# EAGLE design Adafruit STEMMA Soil Sensor (EAGLE 9.2.0)
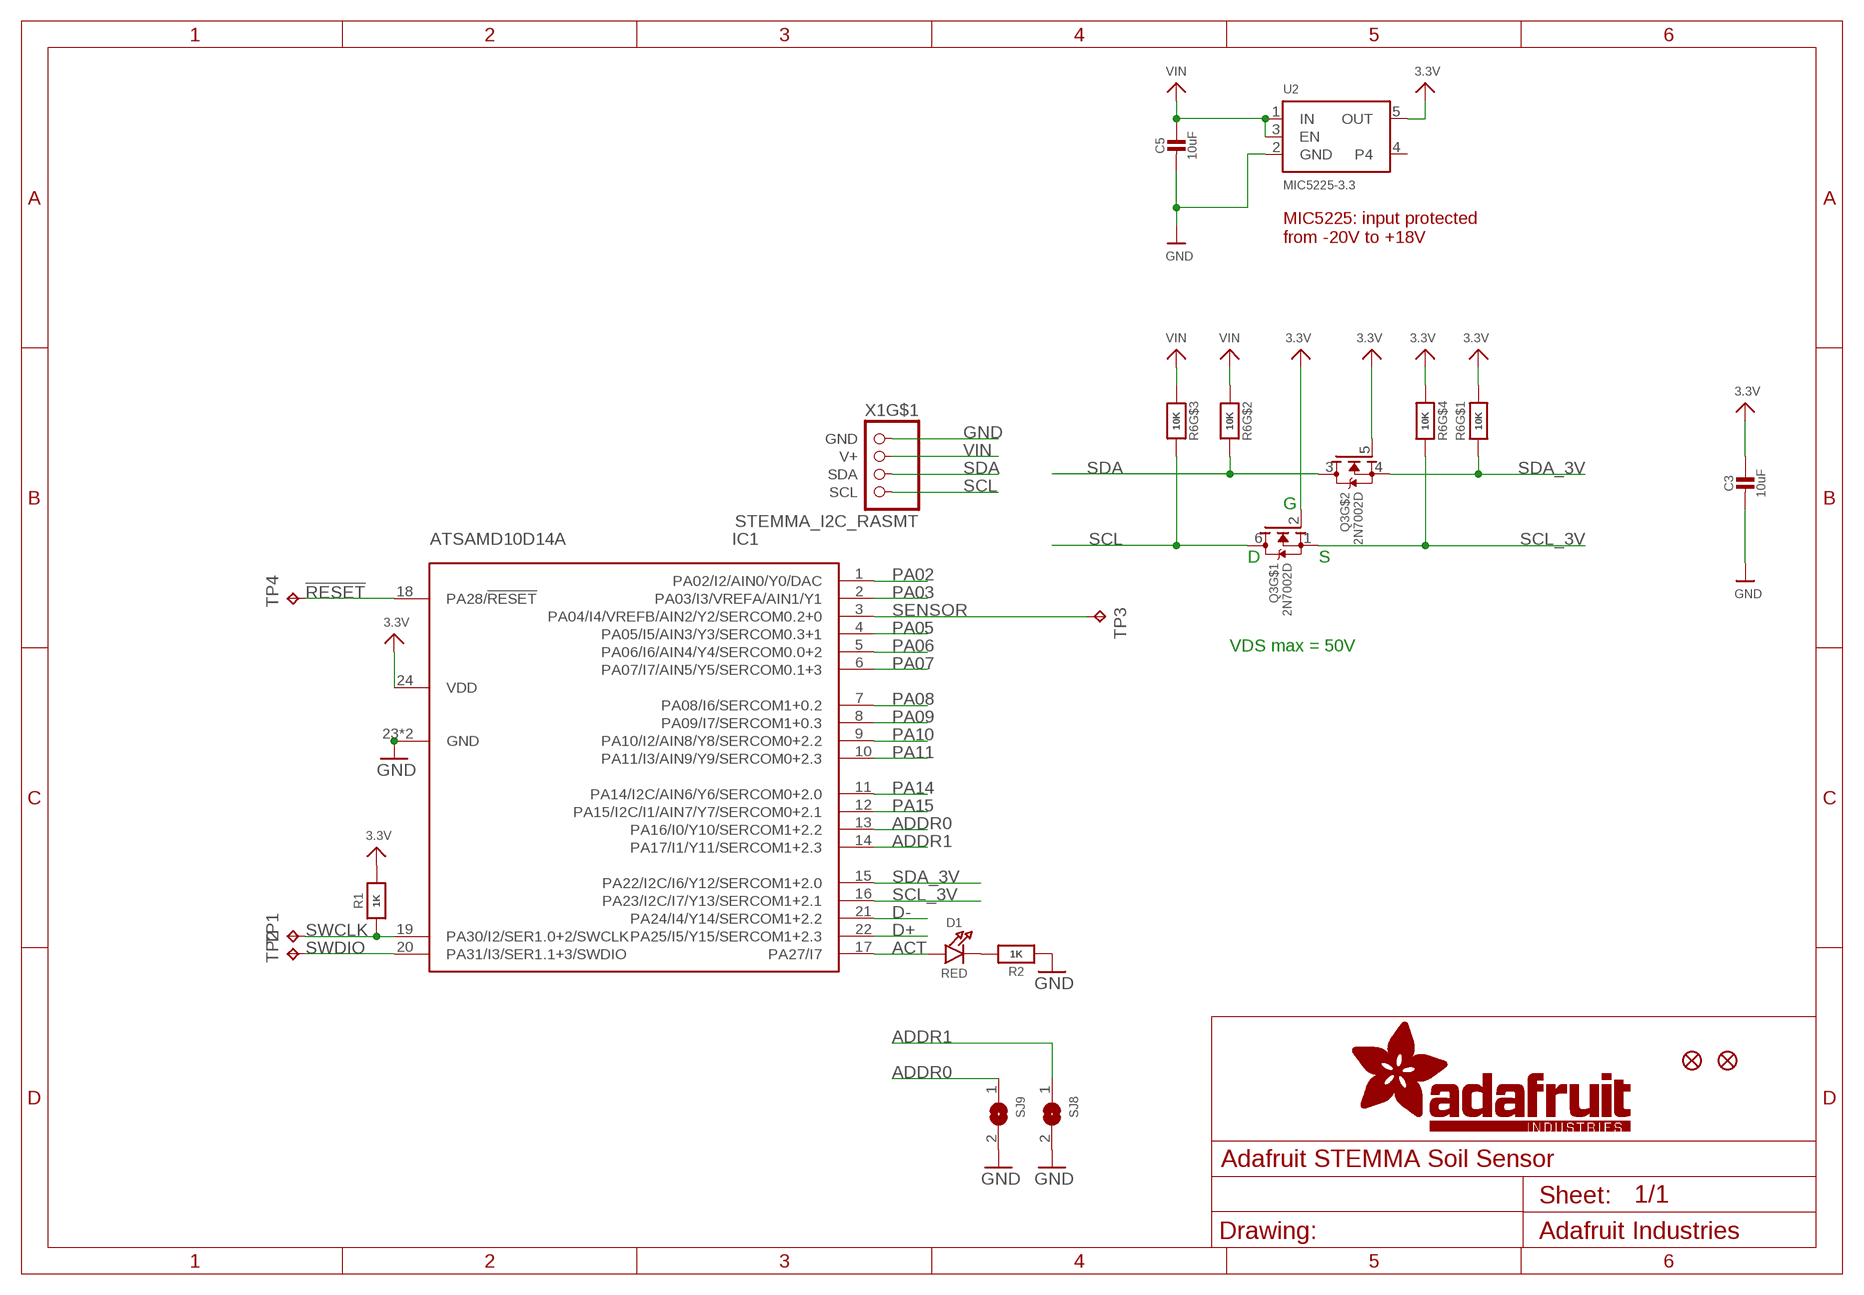
[diagram p0: schematic, sheet 1]

## Parts
C3  10uF  CAP_CERAMIC0805-NOOUTLINE  [0805-NO]
C5  10uF  CAP_CERAMIC0805-NOOUTLINE  [0805-NO]
D1  RED  LED0805_NOOUTLINE  [CHIPLED_0805_NOOUTLINE]
FID1  FIDUCIAL_1MM  [FIDUCIAL_1MM]
FID2  FIDUCIAL_1MM  [FIDUCIAL_1MM]
IC1  ATSAMD10D14A  [QFN24_4MM]
Q3  2N7002D  MOSFET-N_DUAL  [SOT363]
R1  1K  RESISTOR_0603_NOOUT  [0603-NO]
R2  1K  RESISTOR_0603_NOOUT  [0603-NO]
R6  10K  RESISTOR_4PACK  [RESPACK_4X0603]
SJ8  SOLDERJUMPER  [SOLDERJUMPER_ARROW_NOPASTE]
SJ9  SOLDERJUMPER  [SOLDERJUMPER_ARROW_NOPASTE]
TP1  TPTP15R  [TP15R]
TP2  TPTP15R  [TP15R]
TP3  TPTP10R  [TP10R]
TP4  TPTP15R  [TP15R]
U2  MIC5225-3.3  VREG_SOT23-5  [SOT23-5]
X1  STEMMA_I2C_RASMT  [JSTPH4]

## Nets
3.3V: C3.1 IC1.24(VDD) Q3.2(G) Q3.5(G) R1.2 R6.1 R6.5 U2.5(OUT)
!RESET: IC1.18(PA28/!RESET) TP4.TP
ACT: D1.A IC1.17(PA27/I7)
ADDR0: IC1.13(PA16/I0/Y10/SERCOM1+2.2) SJ9.1
ADDR1: IC1.14(PA17/I1/Y11/SERCOM1+2.3) SJ8.1
D+: IC1.22(PA25/I5/Y15/SERCOM1+2.3)
D-: IC1.21(PA24/I4/Y14/SERCOM1+2.2)
GND: C3.2 C5.2 IC1.23(GND) IC1.THERM(GND) R2.1 SJ8.2 SJ9.2 U2.2(GND) X1.1(GND)
N$2: D1.C R2.2
PA02: IC1.1(PA02/I2/AIN0/Y0/DAC)
PA03: IC1.2(PA03/I3/VREFA/AIN1/Y1)
PA05: IC1.4(PA05/I5/AIN3/Y3/SERCOM0.3+1)
PA06: IC1.5(PA06/I6/AIN4/Y4/SERCOM0.0+2)
PA07: IC1.6(PA07/I7/AIN5/Y5/SERCOM0.1+3)
PA08: IC1.7(PA08/I6/SERCOM1+0.2)
PA09: IC1.8(PA09/I7/SERCOM1+0.3)
PA10: IC1.9(PA10/I2/AIN8/Y8/SERCOM0+2.2)
PA11: IC1.10(PA11/I3/AIN9/Y9/SERCOM0+2.3)
PA14: IC1.11(PA14/I2C/AIN6/Y6/SERCOM0+2.0)
PA15: IC1.12(PA15/I2C/I1/AIN7/Y7/SERCOM0+2.1)
SCL: Q3.6(D) R6.6 X1.4(SCL)
SCL_3V: IC1.16(PA23/I2C/I7/Y13/SERCOM1+2.1) Q3.1(S) R6.4
SDA: Q3.3(D) R6.7 X1.3(SDA)
SDA_3V: IC1.15(PA22/I2C/I6/Y12/SERCOM1+2.0) Q3.4(S) R6.8
SENSOR: IC1.3(PA04/I4/VREFB/AIN2/Y2/SERCOM0.2+0) TP3.TP
SWCLK: IC1.19(PA30/I2/SER1.0+2/SWCLK) R1.1 TP1.TP
SWDIO: IC1.20(PA31/I3/SER1.1+3/SWDIO) TP2.TP
VIN: C5.1 R6.2 R6.3 U2.1(IN) U2.3(EN) X1.2(V+)
Unconnected: U2.4 X1.NC1(MT) X1.NC2(MT)

## Notes on the sheet
- MIC5225: input protected
  from -20V to +18V
- G
- D | S
- VDS max = 50V

## Library data of the parts
C3 C5 = microbuilder:CAP_CERAMIC: Ceramic Capacitors For new designs, use the packages preceded by an '_' character since they are more reliable: The following footprints should be used on most boards: _0402 - Standard footprint for regular board layouts _0603 - Standard footprint for regular board layouts _0805 - Standard footprint for regular board layouts _1206 - Standard footprint for regular board layouts For extremely tight-pitch boards where space is at a premium, the following 'micro-pitch' footprints can be used (smaller pads, no silkscreen outline, etc.): _0402MP - Micro-pitch footprint for very dense/compact boards _0603MP - Micro-pitch footprint for very dense/compact boards _0805MP - Micro-pitch footprint for very dense/compact boards _1206MP - Micro-pitch footprint for very dense/compact boards
D1 = microbuilder:LED: LED 0603 - 0603 Surface Mount Package 2mA: Green LED - Low Power (3.9mcd, 2ma, 1.7Vf) - Digikey: 475-2709-2-ND Orange LED - Low Power (9.8mcd, 2ma, 1.8Vf) - Digikey: 475-1194-2-ND Red LED - Low Power (5mcd, 2ma, 1.8Vf) - Digikey: 475-1195-2-ND Yellow LED - Low Power (7mcd, 2ma, 1.8Vf) - Digikey: 475-1196-2-ND 5mA: Blue LED - Low Power (17mcd, 5ma, 2.9Vf) - Digikey: LNJ937W8CRACT-ND 0805 - 0805 Surface Mount Package 2mA: Red LED (8.8mcd, 2mA, 1.8Vf, Clear) - Low Power [Digikey: 475-2510-1-ND] Green LED (5mcd, 2mA, 1.8Vf, Clear) - Low Power [Digikey: 475-2730-1-ND] Yellow LED (11.3mcd, 2mA, 1.8Vf, Clear) - Low Power [Digikey: 475-2555-1-ND] 20mA: Red LED (104mcd, 20mA, Diffused) - LS R976 [Digikey: 475-1278-6-ND] Red LED (12mcd, 20mA, 2.0Vf, Clear) - APT2012EC [Digikey: 754-1128-1-ND] Green LED (15mcd, 20mA, 2.2Vf, Clear) - APT2012GC [Digikey: 754-1131-1-ND] Orange LED (160mcd, 20mA, 2.1Vf, Clear) - APT2012SECK [Digikey: 754-1130-1-ND] 1206 - 1206 Surface Mount Package Green LED (26mcd, 20mA, Diffused) - LG N971 [Digikey: 475-1407-6-ND] Red LED (15mcd, 20mA, Diffused) - LH N974 [Digikey: 475-1416-6-ND] Cree - Cree High-Power Surface Mount LEDs XPEBWT-L1-0000-00D50 - White 111lm 350mA 2.9Vf 6200K 110° XTEAWT-00-0000-00000LEE3 - White 114lm 350mA 2.85Vf 5000K 115° Everlight - Everlight 45-21 Series Surface Mount LEDs 45-21/QK2C-B2832AC2CB2/2T - Warm White 2000mcd 20mA 3.25Vf 3050K 120° 45-21/LK2C-B38452C4CB2/2T - Nuetral White 2000mcd 20mA 3.25Vf 4150K 120° 45-21/LK2C-B50634C6CB2/2T - Cold White 2200mcd 20mA 3.25Vf 5650K 120° PLCC2 Reverse Mount LS T77K-J1L2-1-0-2-R18-Z - Red 11.25mcd 2mA 1.8Vf 630nm 120° LO T77K-L1M2-24-Z - Orange 19.6mcd 2mA 1.8Vf 606nm 120° LY T77K-K2M1-26-Z - Yellow 15.7mcd 2mA 1.8Vf 587nm 120°
FID1 FID2 = microbuilder:FIDUCIAL: Fiducial Alignment Points Various fiducial points for machine vision alignment.; BOM: EXCLUDE
IC1 = microbuilder:ATSAMD10D14A
Q3 = microbuilder:MOSFET-N_DUAL: Dual N-Channel MOSFET SOT363 (2.0x1.25mm) 2N7002PS - 60V, 320mA [Digikey: 568-5984-1-ND]
R1 R2 = microbuilder:RESISTOR: Resistors For new designs, use the packages preceded by an '_' character since they are more reliable: The following footprints should be used on most boards: _0402 - Standard footprint for regular board layouts _0603 - Standard footprint for regular board layouts _0805 - Standard footprint for regular board layouts _1206 - Standard footprint for regular board layouts For extremely tight-pitch boards where space is at a premium, the following 'micro-pitch' footprints can be used (smaller pads, no silkscreen outline, etc.): _0402MP - Micro-pitch footprint for very dense/compact boards _0603MP - Micro-pitch footprint for very dense/compact boards _0805MP - Micro-pitch footprint for very dense/compact boards _1206MP - Micro-pitch footprint for very dense/compact boards
R6 = microbuilder:RESISTOR_4PACK: Resistor Packs (4 resistors) 4 x 0603 10K 1/16W - Digikey: YC164J-10KCT-ND
SJ8 SJ9 = microbuilder:SOLDERJUMPER: SMD Solder JUMPER Solder the two pads together to create a connection, or remove the solder to break it. REFLOW - Use this footprint for solder paste and reflow ovens. WAVE - Use this footprint for hand-soldering (larger pads). CLOSED - Has a trace between the two pads to ensure it is closed by default. The trace needs to be cut to disable the jumper, and can be closed again by creating a solder bridge between the two pads.; BOM: EXCLUDE
TP1-TP4 = testpad:TP: Test pad
U2 = microbuilder:VREG_SOT23-5: SOT23-5 Fixed Voltage Regulators Part Current Out V Out V In V Dropout θJA (°C/W) TJ (°C) Digikey Part No. ADP121 150mA 3.3V 3.4-5.5V 0.09V @ 150mA -- -- ADP121-AUJZ33R7CT-ND ADP121 150mA 3.0V 3.1-5.5V 0.09V @ 150mA -- -- ADP121-AUJZ30R7CT-ND ADP122 300mA 3.3V 3.4-5.5V 0.085V @ 300mA -- -- ADP122AUJZ-3.3-R7CT-ND ADP1712 300mA 3.3V 3.5-5.5V 0.17V @ 300mA -- -- ADP1712AUJZ-3.3-R7TR-ND AP7311 (Low Cost) 150mA 3.3V 3.5-6V 0.15V @ 150mA -- -- AP7311-33WG-7DICT-ND LD39015M18R 150mA 1.8V 1.9V-5.5V 0.08V @ 100mA -- -- 497-6977-1-ND LP2985A-33DBVR 150mA 3.3V 3.3-16V 0.28V @ 150mA 206 150 296-18479-1-ND MCP1824T-3302E/OT 300mA 3.3V 3.5V-6V 0.2V @ 300mA -- -- MCP1824T-3302E/OTCT-ND MIC5205-2.5YM5 TR 150mA 2.5V 2.7-16V 0.165V @ 150mA -- -- 576-1257-2-ND MIC5205-3.0YM5 TR 150mA 3.0V 3.2V-16V 0.165V @ 150mA -- -- 576-1258-2-ND MIC5205-3.3YM5 TR 150mA 3.3V 3.5V-16V 0.165V @ 150mA -- -- 576-1259-2-ND TPS780330220 150mA 3.3V+2.2V 3.6-5.5V 250mV Max -- -- 296-23332-1-ND TDA3663/N1,135 100mA 3.3V 3.5-45V 0.18V @ 50mA -- -- 568-5343-1-ND Max operating temp can be calculated using θJA, TJ (max junction temperature), and power in watts. Set the "Maximum Ambient Temperature" until it reaches TJ ("Max Junction Temperature"), which is the absolute limit for safe use of the regulator: Heat Sink Temperature Calculator <http://www.daycounter.com/Calculators/Heat-Sink-Temperature-Calculator.phtml> For example, With 12V source into a 3.3V LP2985 and a 30mA load, we are dissipating (12V-3.3V) * 0.03A = 0.261W. With a θJA of 206 °C/W, a TJ of 150°C, and 261mW we can safely use the chip without a heat sink up to 75°C (=147.1°C Junction Temperature).
X1 = microbuilder:STEMMA_I2C

## Board
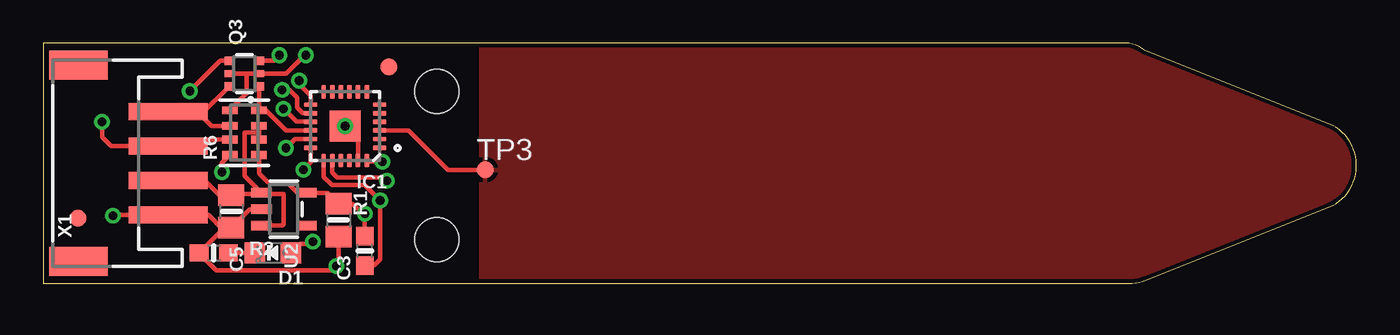
[diagram p1: board, top side]
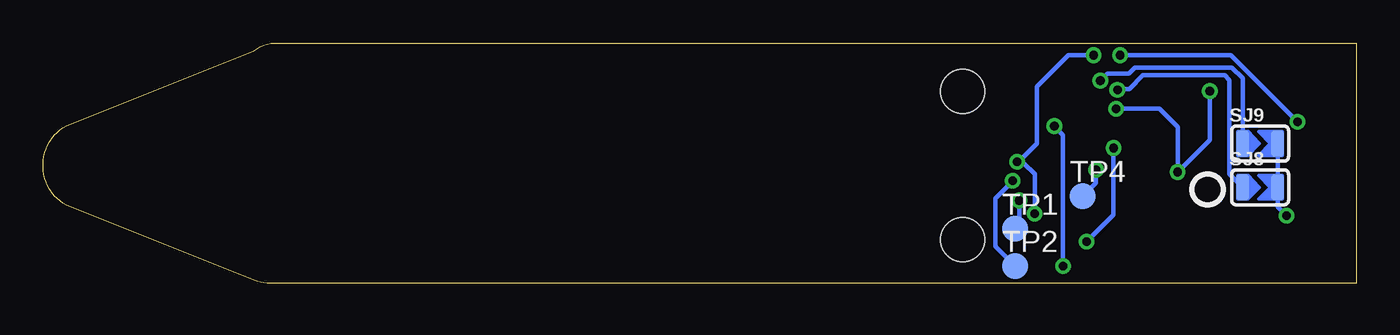
[diagram p2: board, bottom side, seen from below]

Size 76.2 x 13.97 mm. Coordinates in mm from the lower left corner, seen from the top.
Outline: 0,13.97 0,0 63.01,0 arc22 63.95,0.18 74.6,4.44 arc68 76.2,6.8 76.2,6.92 arc68 74.6,9.28 63.95,13.53 arc22 63.01,13.97 0,13.97
Copper layers (1*16): Top 0.035mm / dielectric 1.5mm / Bottom 0.035mm
Design rules "adafruit *": minimum track width 8mil, minimum drill 15.5mil, track to track 8mil, track to pad 8mil, pad to pad 8mil, via to via 8mil, smd to smd 8mil, copper to edge 10mil, drill to drill 8mil, minimum pad ring 10mil, minimum via ring 8mil, stop-mask expansion 2mil, vias tented up to drill 20mil, thermal gap 10mil
Holes 2.54 mm at 22.86,11.18 22.86,2.54

### Footprints (pad centres in the part's own frame; a part is rotated, then mirrored left to right if it is on the bottom)
0805-NO = smd 1.24 x 1.5: 1 -0.95,0; 2 0.95,0
CHIPLED_0805_NOOUTLINE = smd 1.2 x 1.2: A 0,-1.05; C 0,1.05
FIDUCIAL_1MM = smd 1 x 1: 1 0,0
QFN24_4MM = smd 0.8 x 0.28: 1 -2,1.25; 2 -2,0.75; 3 -2,0.25; 4 -2,-0.25; 5 -2,-0.75; 6 -2,-1.25; 13 2,-1.25; 14 2,-0.75; 15 2,-0.25; 16 2,0.25; 17 2,0.75; 18 2,1.25 | smd 0.28 x 0.8: 7 -1.25,-2; 8 -0.75,-2; 9 -0.25,-2; 10 0.25,-2; 11 0.75,-2; 12 1.25,-2; 19 1.25,2; 20 0.75,2; 21 0.25,2; 22 -0.25,2; 23 -0.75,2; 24 -1.25,2 | smd 1.778 x 1.778: THERM 0,0
SOT363 = smd 0.5 x 0.5: 1 -0.75,-0.9; 3 0.75,-0.9; 4 0.75,0.9; 6 -0.75,0.9 | smd 0.4 x 0.5: 2 0,-0.9; 5 0,0.9
0603-NO = smd 1.075 x 1: 1 -0.85,0; 2 0.85,0
RESPACK_4X0603 = smd 0.45 x 0.9: 1 -1.3,-0.85; 2 -0.4,-0.85; 3 0.4,-0.85; 4 1.3,-0.85; 5 1.3,0.85; 6 0.4,0.85; 7 -0.4,0.85; 8 -1.3,0.85
SOLDERJUMPER_ARROW_NOPASTE = smd 0.762 x 1.524: 1 -1.016,0; 2 1.016,0
TP15R = smd 1.5 x 1.5: TP 0,0
TP10R = smd 1 x 1: TP 0,0
SOT23-5 = smd 0.55 x 1.2: 1 -0.95,-1.3; 2 0,-1.3; 3 0.95,-1.3; 4 0.95,1.3; 5 -0.95,1.3
JSTPH4 = smd 1 x 4.6: 1 -3,-3.7; 2 -1,-3.7; 3 1,-3.7; 4 3,-3.7 | smd 1.7 x 3.4: NC1 -5.7,1.5; NC2 5.7,1.5

### Placement (x,y rotation side)
C3  17.14,3.68 270 top
C5  10.92,4.19 270 top
D1  13.34,1.78 90 top
FID1  20.07,12.57 0 top
FID2  2.03,3.81 0 top
IC1  17.53,9.14 180 top
Q3  11.68,12.19 90 top
R1  18.67,1.91 90 top
R2  9.91,1.78 0 top
R6  11.68,8.76 90 top
SJ8  5.59,5.59 0 bottom
SJ9  5.59,8.13 0 bottom
TP1  19.81,3.17 0 bottom
TP2  19.81,1.02 0 bottom
TP3  25.65,6.6 0 top
TP4  15.88,5.08 0 bottom
U2  13.97,4.32 270 top
U$4  [STEMMA_SOIL_BOT]  76.33,0 0 bottom
U$5  [STEMMA_SOIL_TOP]  0,0 0 top
U$12  [PCBFEAT-REV-040]  8.64,5.46 0 bottom
X1  3.56,6.99 90 top

### Tracks (layer width: path | path; a pad name or v marks a point on that pad's centre or on a via)
3.3V  (via drill 0.5)
  Top 0.254: R6.5 10.83,10.07 11.81,11.05 11.81,12.19 | 11.81,12.19 Q3.5 | 11.81,12.19 Q3.2 14.1,12.19 15.17,13.26 v15.24,13.26 | R6.1 12.53,6.39 13.05,5.87 14.16,5.87 14.76,5.27 U2.5 16.51,5.27 C3.1 17.97,4.63 18.54,4.06 v18.67,4.06 R1.2 | v19.68,7.08 18.84,7.08 IC1.24
  Bottom 0.254: v15.24,13.26 16.71,13.26 18.54,11.43 18.54,8.13 19.68,6.99 | v19.68,7.08 19.68,6.99 | 19.68,6.99 19.3,6.99 18.67,6.35 v18.67,4.06
!RESET  (via drill 0.5)
  Top 0.254: IC1.18 15.53,7.02 v15.11,6.6
  Bottom 0.254: v15.11,6.6 15.11,5.84 TP4.TP
ACT  (via drill 0.5)
  Top 0.254: IC1.17 14.62,8.39 v14.1,7.87 | D1.A 14.91,2.31 15.53,2.31 v15.65,2.43
  Bottom 0.254: v14.1,7.87 14.1,3.99 v15.65,2.43
ADDR0  (via drill 0.5)
  Top 0.254: v14.86,11.79 14.86,11.57 15.53,10.9 IC1.13
  Bottom 0.254: SJ9.1 6.6,11.93 7.23,12.55 12.85,12.55 13.21,12.19 14.46,12.19 v14.86,11.79
ADDR1  (via drill 0.5)
  Top 0.254: IC1.14 15.06,9.89 14.73,10.22 14.73,10.79 14.27,11.26 v13.87,11.26
  Bottom 0.254: SJ8.1 7.37,6.35 7.37,11.81 7.65,12.09 12.38,12.09 13.19,11.29 13.84,11.29 v13.87,11.26
GND  (via drill 0.5)
  Top 0.254: C3.2 17.14,1.14 v17.02,1.02 16.76,0.76 10.03,0.76 9.06,1.74 R2.1 10.43,3.15 | IC1.23 18.28,8.39 IC1.THERM | 10.43,3.15 10.52,3.24 C5.2 12,4.32 U2.2 | 10.43,3.15 9.6,3.98 X1.1 4.11,3.98 v4.06,3.94
  Bottom 0.254: SJ9.2 SJ8.2 4.57,4.45 v4.06,3.94 | IC1.THERM 17.02,8.64 v17.02,1.02
  other vias: 17.53,9.14
N$2
  Top 0.254: D1.C R2.2
SCL
  Top 0.254: R6.6 10.81,9.14 9.78,9.14 9.14,9.78 9.14,9.86 | Q3.6 9.2,9.86 9.14,9.86 | X1.4 9.14,9.98 9.14,9.86
SCL_3V
  Top 0.254: IC1.16 14.09,8.89 12.92,10.06 R6.4 12.53,11.39 Q3.1
SDA  (via drill 0.5)
  Top 0.254: R6.7 9.63,8.36 9.26,7.99 X1.3 3.95,7.99 3.42,8.51 3.42,9.38 v3.41,9.4 | Q3.3 13.39,12.94 v13.72,13.26
  Bottom 0.254: v13.72,13.26 7.29,13.26 3.43,9.4 v3.41,9.4
SDA_3V  (via drill 0.5)
  Top 0.254: Q3.4 10.28,12.94 v8.51,11.18 | IC1.15 14.71,9.39 v13.95,10.15 | R6.8 10.37,6.99 v10.37,6.48
  Bottom 0.254: v8.51,11.18 8.51,8.33 v10.37,6.48 10.37,9.1 11.42,10.15 v13.95,10.15
SENSOR
  Top 0.254: IC1.3 21.2,8.89 23.5,6.6 TP3.TP
  pour Top: 25.4,13.97 76.2,13.97 76.2,0 25.4,0
SWCLK  (via drill 0.5)
  Top 0.254: IC1.19 16.28,6.2 16.76,5.71 18.67,5.71 v19.56,4.83 19.56,1.4 19.22,1.05 R1.1
  Bottom 0.254: v19.56,4.83 19.56,3.43 TP1.TP
SWDIO  (via drill 0.5)
  Top 0.254: IC1.20 16.78,6.44 17.05,6.17 19.74,6.17 v19.94,5.97
  Bottom 0.254: TP2.TP 20.95,2.16 20.95,4.95 v19.94,5.97
VIN
  Top 0.254: R6.3 12.53,8.76 | 12.53,8.76 R6.2 | 12.53,8.76 11.68,8.76 11.68,6.25 U2.1 12.57,5.27 12.63,5.21 | U2.3 13.91,3.37 13.97,3.43 13.97,5.21 12.83,5.21 12.63,5.21 | X1.2 9.38,5.99 10.23,5.14 C5.1 10.99,5.21 12.63,5.21